# Altium schematic sheet [4] ADC_DECOUPLING.SchDoc: ADC Decoupling
size 393 x 281 mm; SheetNumber: 4; SheetTotal: 21; PageSetup: Record=PageOptions|CenterHorizontal=True|CenterVertical=True|PrintScale=0.94|XCorrection=0.00|YCorrection=0.00|PrintKind=0|BorderSize=5000000|LeftOffset=0|BottomOffset=0|Orientation=2|PaperLength=1000|PaperWidth=1000|Scale=100|PaperSource=15|PrintQuality=600|MediaType=1|DitherType=10|PrintScaleMode=1|PaperKind=A4; Adr1: August Barks gata 6B; Adr2: SE-421 32 Västra Frölunda; Adr3: Sweden; Webpage: www.omnisys.se
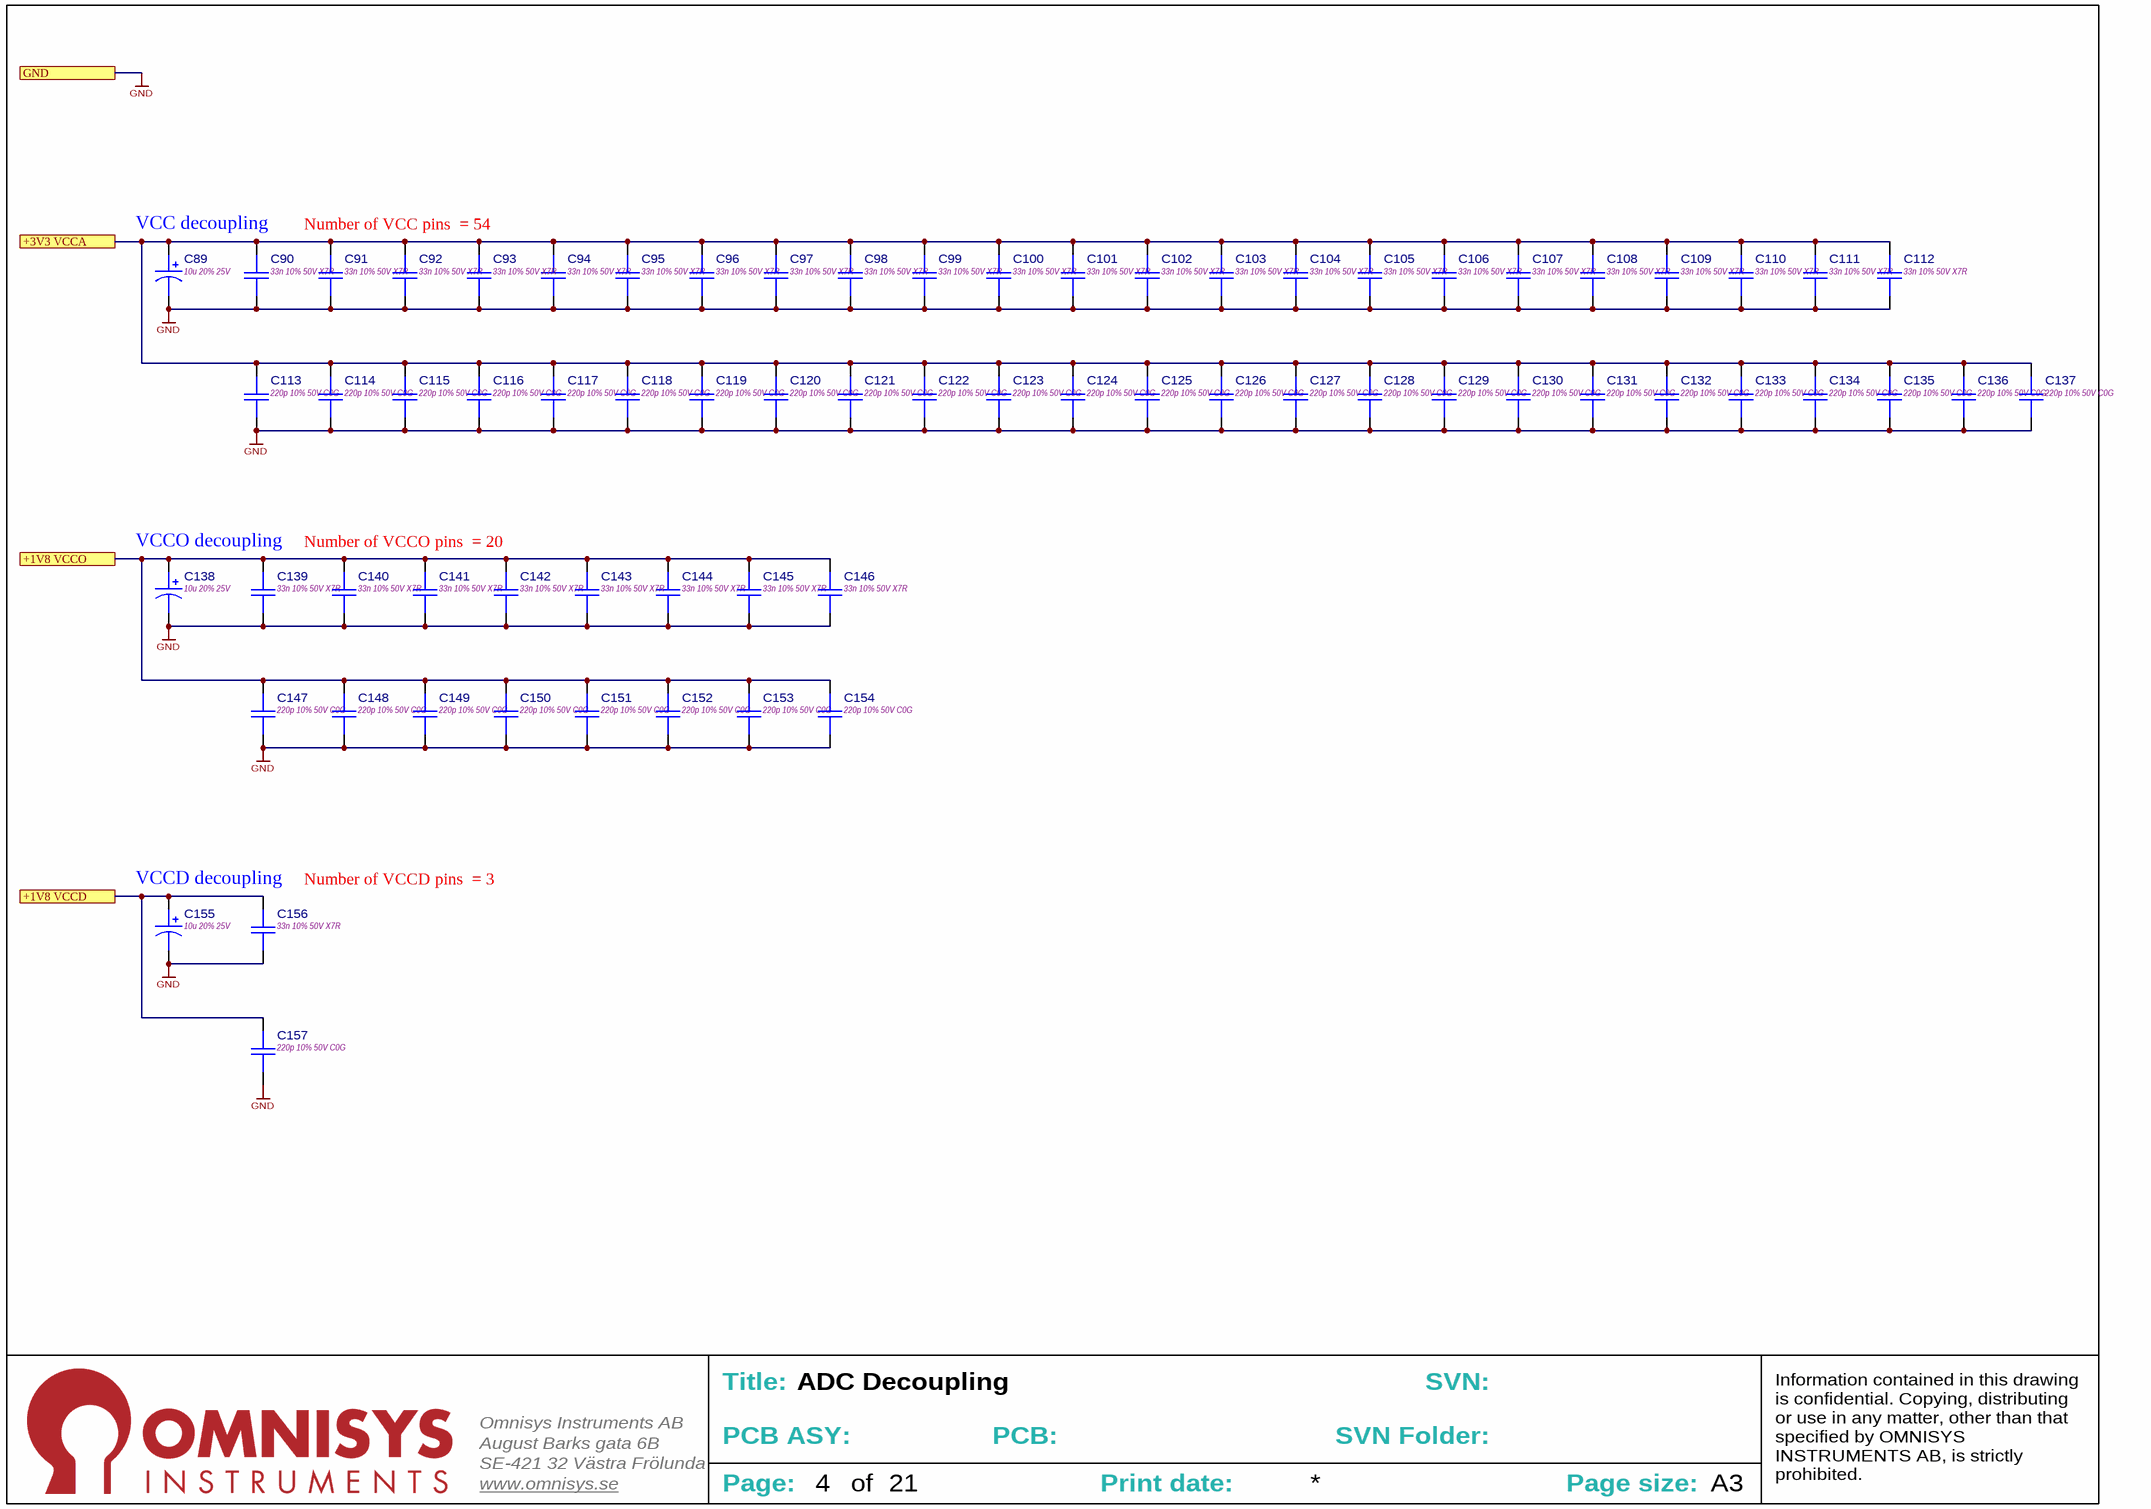
[diagram p0: [4] ADC_DECOUPLING.SchDoc]

## Parts
C89  10u 20% 25V  [CAPMP3528X21N]
C90  33n 10% 50V X7R  [CAPC1005X55L]
C91  33n 10% 50V X7R  [CAPC1005X55L]
C92  33n 10% 50V X7R  [CAPC1005X55L]
C93  33n 10% 50V X7R  [CAPC1005X55L]
C94  33n 10% 50V X7R  [CAPC1005X55L]
C95  33n 10% 50V X7R  [CAPC1005X55L]
C96  33n 10% 50V X7R  [CAPC1005X55L]
C97  33n 10% 50V X7R  [CAPC1005X55L]
C98  33n 10% 50V X7R  [CAPC1005X55L]
C99  33n 10% 50V X7R  [CAPC1005X55L]
C100  33n 10% 50V X7R  [CAPC1005X55L]
C101  33n 10% 50V X7R  [CAPC1005X55L]
C102  33n 10% 50V X7R  [CAPC1005X55L]
C103  33n 10% 50V X7R  [CAPC1005X55L]
C104  33n 10% 50V X7R  [CAPC1005X55L]
C105  33n 10% 50V X7R  [CAPC1005X55L]
C106  33n 10% 50V X7R  [CAPC1005X55L]
C107  33n 10% 50V X7R  [CAPC1005X55L]
C108  33n 10% 50V X7R  [CAPC1005X55L]
C109  33n 10% 50V X7R  [CAPC1005X55L]
C110  33n 10% 50V X7R  [CAPC1005X55L]
C111  33n 10% 50V X7R  [CAPC1005X55L]
C112  33n 10% 50V X7R  [CAPC1005X55L]
C113  220p 10% 50V C0G  [CAPC1005X55L]
C114  220p 10% 50V C0G  [CAPC1005X55L]
C115  220p 10% 50V C0G  [CAPC1005X55L]
C116  220p 10% 50V C0G  [CAPC1005X55L]
C117  220p 10% 50V C0G  [CAPC1005X55L]
C118  220p 10% 50V C0G  [CAPC1005X55L]
C119  220p 10% 50V C0G  [CAPC1005X55L]
C120  220p 10% 50V C0G  [CAPC1005X55L]
C121  220p 10% 50V C0G  [CAPC1005X55L]
C122  220p 10% 50V C0G  [CAPC1005X55L]
C123  220p 10% 50V C0G  [CAPC1005X55L]
C124  220p 10% 50V C0G  [CAPC1005X55L]
C125  220p 10% 50V C0G  [CAPC1005X55L]
C126  220p 10% 50V C0G  [CAPC1005X55L]
C127  220p 10% 50V C0G  [CAPC1005X55L]
C128  220p 10% 50V C0G  [CAPC1005X55L]
C129  220p 10% 50V C0G  [CAPC1005X55L]
C130  220p 10% 50V C0G  [CAPC1005X55L]
C131  220p 10% 50V C0G  [CAPC1005X55L]
C132  220p 10% 50V C0G  [CAPC1005X55L]
C133  220p 10% 50V C0G  [CAPC1005X55L]
C134  220p 10% 50V C0G  [CAPC1005X55L]
C135  220p 10% 50V C0G  [CAPC1005X55L]
C136  220p 10% 50V C0G  [CAPC1005X55L]
C137  220p 10% 50V C0G  [CAPC1005X55L]
C138  10u 20% 25V  [CAPMP3528X21N]
C139  33n 10% 50V X7R  [CAPC1005X55N]
C140  33n 10% 50V X7R  [CAPC1005X55N]
C141  33n 10% 50V X7R  [CAPC1005X55N]
C142  33n 10% 50V X7R  [CAPC1005X55N]
C143  33n 10% 50V X7R  [CAPC1005X55N]
C144  33n 10% 50V X7R  [CAPC1005X55N]
C145  33n 10% 50V X7R  [CAPC1005X55N]
C146  33n 10% 50V X7R  [CAPC1005X55N]
C147  220p 10% 50V C0G  [CAPC1005X55N]
C148  220p 10% 50V C0G  [CAPC1005X55N]
C149  220p 10% 50V C0G  [CAPC1005X55N]
C150  220p 10% 50V C0G  [CAPC1005X55N]
C151  220p 10% 50V C0G  [CAPC1005X55N]
C152  220p 10% 50V C0G  [CAPC1005X55N]
C153  220p 10% 50V C0G  [CAPC1005X55N]
C154  220p 10% 50V C0G  [CAPC1005X55N]
C155  10u 20% 25V  [CAPMP3528X21N]
C156  33n 10% 50V X7R  [CAPC1005X55N]
C157  220p 10% 50V C0G  [CAPC1005X55N]

## Ports
+1V8 VCCD, +1V8 VCCO, +3V3 VCCA, GND

## Nets
GND: C89.2 C90.1 C91.1 C92.1 C93.1 C94.1 C95.1 C96.1 C97.1 C98.1 C99.1 C100.1 C101.1 C102.1 C103.1 C104.1 C105.1 C106.1 C107.1 C108.1 C109.1 C110.1 C111.1 C112.1 C113.1 C114.1 C115.1 C116.1 C117.1 C118.1 C119.1 C120.1 C121.1 C122.1 C123.1 C124.1 C125.1 C126.1 C127.1 C128.1 C129.1 C130.1 C131.1 C132.1 C133.1 C134.1 C135.1 C136.1 C137.1 C138.2 C139.1 C140.1 C141.1 C142.1 C143.1 C144.1 C145.1 C146.1 C147.1 C148.1 C149.1 C150.1 C151.1 C152.1 C153.1 C154.1 C155.2 C156.1 C157.1 ; port GND
+1V8 VCCD: C155.1 C156.2 C157.2 ; port +1V8 VCCD
+1V8 VCCO: C138.1 C139.2 C140.2 C141.2 C142.2 C143.2 C144.2 C145.2 C146.2 C147.2 C148.2 C149.2 C150.2 C151.2 C152.2 C153.2 C154.2 ; port +1V8 VCCO
+3V3 VCCA: C89.1 C90.2 C91.2 C92.2 C93.2 C94.2 C95.2 C96.2 C97.2 C98.2 C99.2 C100.2 C101.2 C102.2 C103.2 C104.2 C105.2 C106.2 C107.2 C108.2 C109.2 C110.2 C111.2 C112.2 C113.2 C114.2 C115.2 C116.2 C117.2 C118.2 C119.2 C120.2 C121.2 C122.2 C123.2 C124.2 C125.2 C126.2 C127.2 C128.2 C129.2 C130.2 C131.2 C132.2 C133.2 C134.2 C135.2 C136.2 C137.2 ; port +3V3 VCCA

## Notes on the sheet
- VCC decoupling
- Number of VCC pins  = 54
- VCCO decoupling
- Number of VCCO pins  = 20
- VCCD decoupling
- (near C156) Number of VCCD pins  = 3
- Title:
- SVN:
- August Barks gata 6B
- SE-421 32 Västra Frölunda
- Omnisys Instruments AB
- PCB ASY:
- PCB:
- SVN Folder:
- www.omnisys.se
- Page:
- of
- Print date:
- Page size:
- A3
- Information contained in this drawing is confidential. Copying, distributing or use in any matter, other than that specified by OMNISYS INSTRUMENTS AB, is strictly prohibited.

## Library data of the parts
C89 C138 C155 = CMP-0300-000090-5: Standard tantalum capacitor, 3528/Case B; DCL: 2.5A; DF: 6%; ESR: 2.5; Capacitance: 10µF; Tolerance: 20%; Rated Voltage: 25V; Case/Package: 3528
C90-C112 C139-C146 C156 = CMP-0300-002958-5: Ceramic Chip Capacitor, 0402/1005; Capacitance: 33nF; Package: 0402/1005; Temperature Charateristics: X7R; Tolerance: 10%; Thickness: 550µm; Rated Voltage: 50V
C113-C137 C147-C154 C157 = CMP-0300-002795-5: Ceramic Chip Capacitor, 0402/1005; Capacitance: 220pF; Package: 0402/1005; Temperature Charateristics: C0G; Tolerance: 10%; Thickness: 550µm; Rated Voltage: 50V